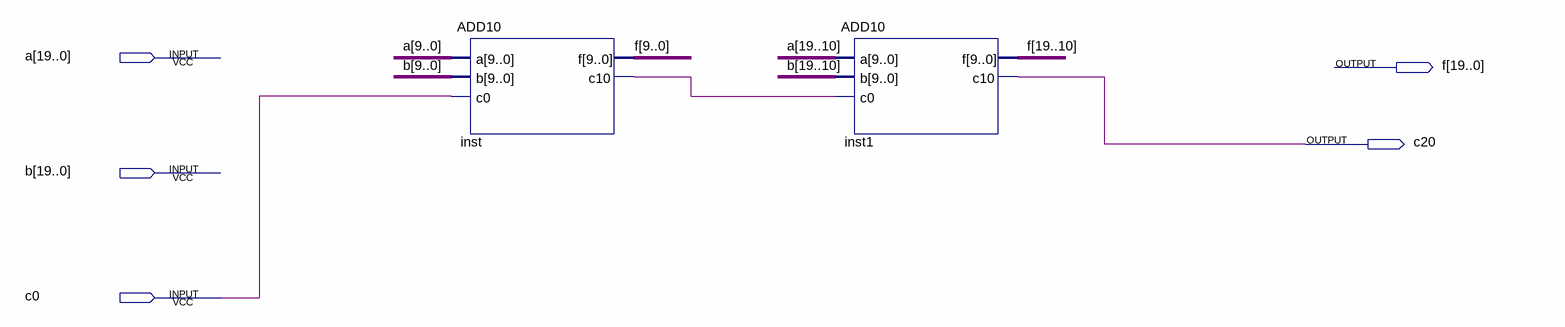
[diagram p0: schematic sheet]
// Quartus schematic ADD20.bdf as structural Verilog: 2 symbols, 5 pins
module ADD20 (
  input  [19:0] a,
  input  [19:0] b,
  input  c0,
  output [19:0] f,
  output c20
);

  wire inst_c10;

  ADD10 inst (.a(a[9:0]), .b(b[9:0]), .c0(c0), .f(f[9:0]), .c10(inst_c10));
  ADD10 inst1 (.a(a[19:10]), .b(b[19:10]), .c0(inst_c10), .f(f[19:10]), .c10(c20));
endmodule
